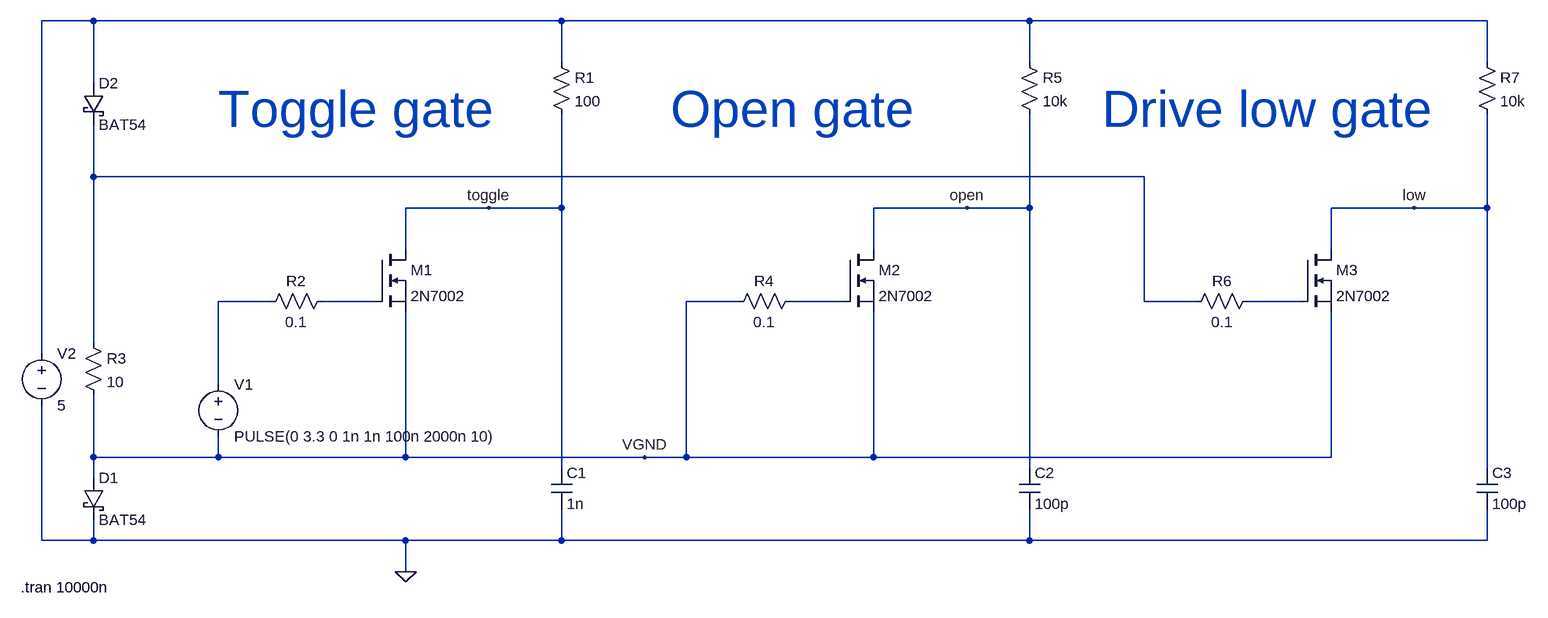
[diagram p0: schematic gnd_bounce.asc]
gnd_bounce.asc, the LTspice schematic file:
Version 4
SHEET 1 1960 680
WIRE -256 -560 -336 -560
WIRE 464 -560 -256 -560
WIRE 1184 -560 464 -560
WIRE 1888 -560 1184 -560
WIRE 464 -496 464 -560
WIRE 1184 -496 1184 -560
WIRE 1888 -496 1888 -560
WIRE -256 -464 -256 -560
WIRE -256 -320 -256 -400
WIRE 1360 -320 -256 -320
WIRE 352 -272 224 -272
WIRE 464 -272 464 -416
WIRE 464 -272 352 -272
WIRE 1088 -272 944 -272
WIRE 1184 -272 1184 -416
WIRE 1184 -272 1088 -272
WIRE 1776 -272 1648 -272
WIRE 1888 -272 1888 -416
WIRE 1888 -272 1776 -272
WIRE 224 -208 224 -272
WIRE 944 -208 944 -272
WIRE 1648 -208 1648 -272
WIRE 16 -128 -64 -128
WIRE 176 -128 96 -128
WIRE 736 -128 656 -128
WIRE 896 -128 816 -128
WIRE 1360 -128 1360 -320
WIRE 1440 -128 1360 -128
WIRE 1600 -128 1520 -128
WIRE -256 -64 -256 -320
WIRE -336 -48 -336 -560
WIRE -64 0 -64 -128
WIRE -256 112 -256 16
WIRE -64 112 -64 80
WIRE -64 112 -256 112
WIRE 224 112 224 -112
WIRE 224 112 -64 112
WIRE 592 112 224 112
WIRE 656 112 656 -128
WIRE 656 112 592 112
WIRE 944 112 944 -112
WIRE 944 112 656 112
WIRE 1648 112 1648 -112
WIRE 1648 112 944 112
WIRE 464 128 464 -272
WIRE 1184 128 1184 -272
WIRE 1888 128 1888 -272
WIRE -256 144 -256 112
WIRE -336 240 -336 32
WIRE -256 240 -256 208
WIRE -256 240 -336 240
WIRE 224 240 -256 240
WIRE 464 240 464 192
WIRE 464 240 224 240
WIRE 1184 240 1184 192
WIRE 1184 240 464 240
WIRE 1888 240 1888 192
WIRE 1888 240 1184 240
WIRE 224 288 224 240
FLAG 224 288 0
FLAG 352 -272 toggle
FLAG 1088 -272 open
FLAG 1776 -272 low
FLAG 592 112 VGND
SYMBOL schottky -272 144 R0
SYMATTR InstName D1
SYMATTR Value BAT54
SYMATTR Description Diode
SYMATTR Type diode
SYMBOL cap 448 128 R0
SYMATTR InstName C1
SYMATTR Value 1n
SYMBOL res 448 -512 R0
SYMATTR InstName R1
SYMATTR Value 100
SYMBOL nmos 176 -208 R0
SYMATTR InstName M1
SYMATTR Value 2N7002
SYMBOL voltage -64 -16 R0
WINDOW 123 0 0 Left 0
WINDOW 39 0 0 Left 0
SYMATTR InstName V1
SYMATTR Value PULSE(0 3.3 0 1n 1n 100n 2000n 10)
SYMBOL res 112 -144 R90
WINDOW 0 0 56 VBottom 2
WINDOW 3 32 56 VTop 2
SYMATTR InstName R2
SYMATTR Value 0.1
SYMBOL voltage -336 -64 R0
SYMATTR InstName V2
SYMATTR Value 5
SYMBOL schottky -272 -464 R0
SYMATTR InstName D2
SYMATTR Value BAT54
SYMATTR Description Diode
SYMATTR Type diode
SYMBOL res -272 -80 R0
SYMATTR InstName R3
SYMATTR Value 10
SYMBOL nmos 896 -208 R0
SYMATTR InstName M2
SYMATTR Value 2N7002
SYMBOL res 832 -144 R90
WINDOW 0 0 56 VBottom 2
WINDOW 3 32 56 VTop 2
SYMATTR InstName R4
SYMATTR Value 0.1
SYMBOL res 1168 -512 R0
SYMATTR InstName R5
SYMATTR Value 10k
SYMBOL cap 1168 128 R0
SYMATTR InstName C2
SYMATTR Value 100p
SYMBOL nmos 1600 -208 R0
SYMATTR InstName M3
SYMATTR Value 2N7002
SYMBOL res 1536 -144 R90
WINDOW 0 0 56 VBottom 2
WINDOW 3 32 56 VTop 2
SYMATTR InstName R6
SYMATTR Value 0.1
SYMBOL res 1872 -512 R0
SYMATTR InstName R7
SYMATTR Value 10k
SYMBOL cap 1872 128 R0
SYMATTR InstName C3
SYMATTR Value 100p
TEXT -368 312 Left 2 !.tran 10000n
TEXT -64 -424 Left 6 ;Toggle gate
TEXT 632 -424 Left 6 ;Open gate
TEXT 1296 -424 Left 6 ;Drive low gate

The netlist it stands for:
* gnd_bounce.asc
D1 VGND 0 BAT54
C1 toggle 0 1n
R1 N001 toggle 100
M1 toggle N004 VGND VGND 2N7002
V1 N003 VGND PULSE(0 3.3 0 1n 1n 100n 2000n 10)
R2 N004 N003 0.1
V2 N001 0 5
D2 N001 N002 BAT54
R3 N002 VGND 10
M2 open N005 VGND VGND 2N7002
R4 N005 VGND 0.1
R5 N001 open 10k
C2 open 0 100p
M3 low N006 VGND VGND 2N7002
R6 N006 N002 0.1
R7 N001 low 10k
C3 low 0 100p
.model D D
.lib standard.dio
.model NMOS NMOS
.model PMOS PMOS
.lib standard.mos
.tran 10000n
* Toggle gate
* Open gate
* Drive low gate
.backanno
.end